# EAGLE schematic pcb_pedale_test-H743-TLV320AIC23B (EAGLE 9.6.2)
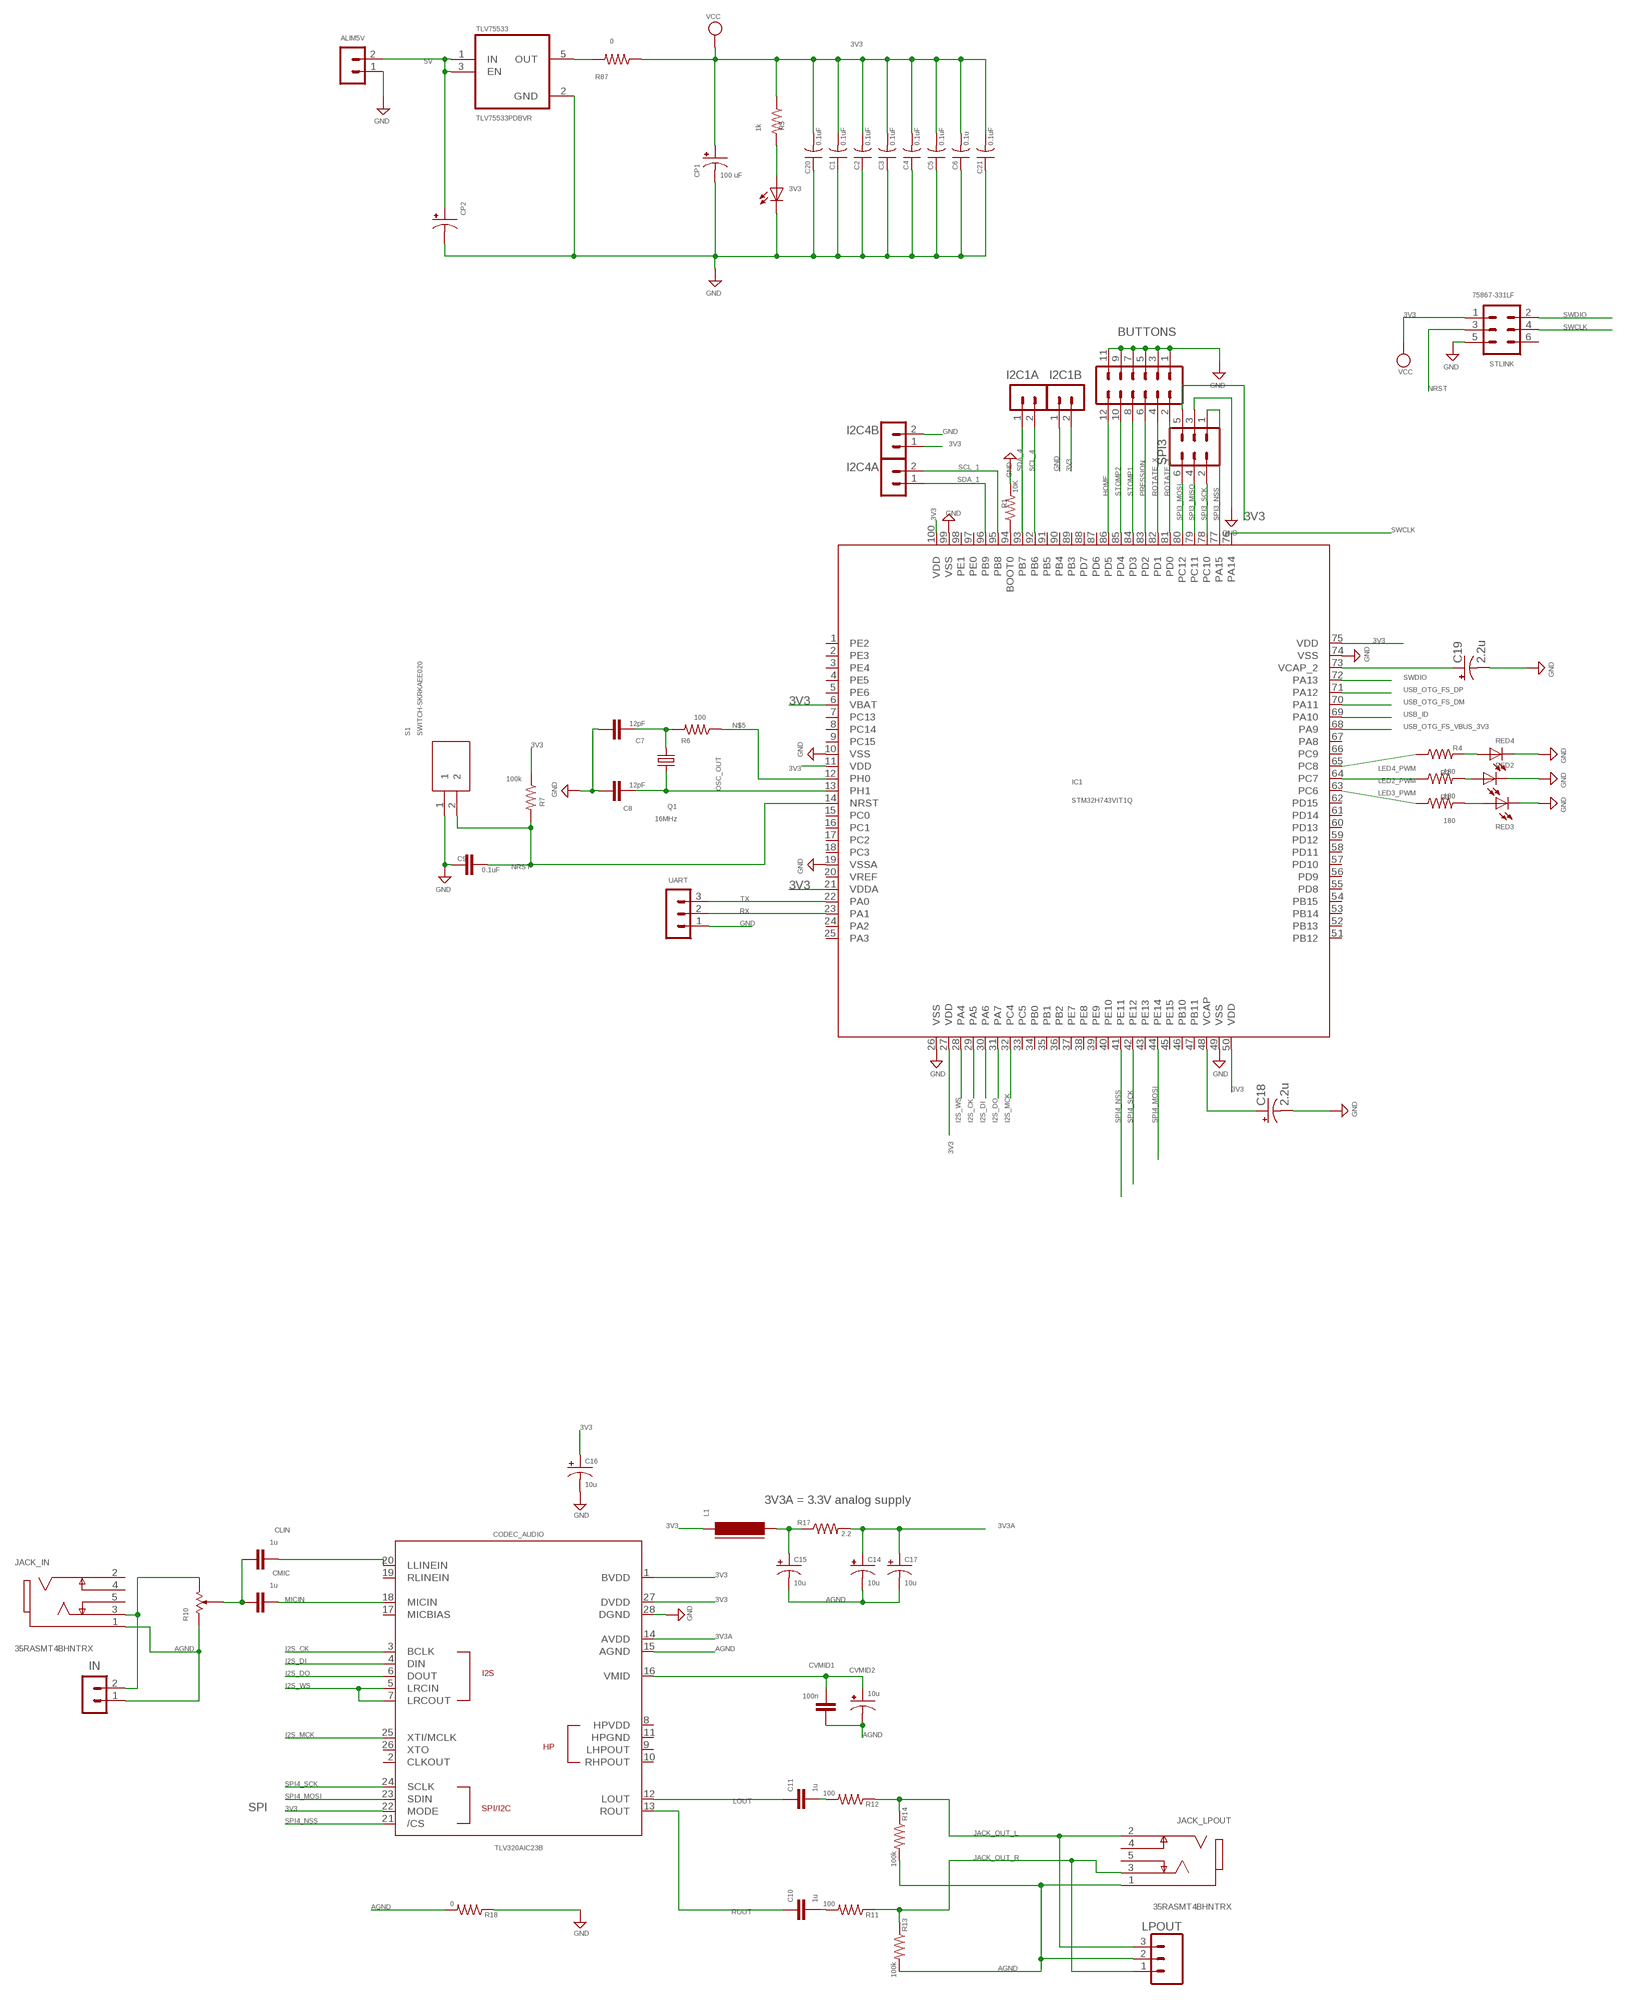
[diagram p0: schematic, sheet 1, part 1 of 2]
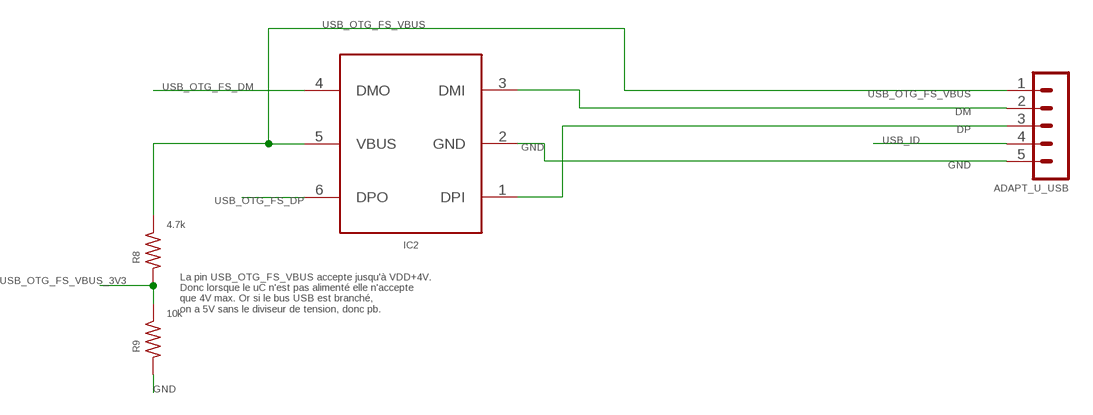
[diagram p1: schematic, sheet 1, part 2 of 2]

## Parts
3V3  LED-0805  [0805-LED]
ADAPT_U_USB  MA05-1  [MA05-1]
ALIM5V  MA02-1  [MA02-1]
BUTTONS  MA06-2  [MA06-2]
C1  0.1uF  C-US0805  [C0805]
C2  0.1uF  C-US0805  [C0805]
C3  0.1uF  C-US0805  [C0805]
C4  0.1uF  C-US0805  [C0805]
C5  0.1uF  C-US0805  [C0805]
C6  0.1u  C-US0805  [C0805]
C7  12pF  PASSIF-CAP-1206  [1206]
C8  12pF  PASSIF-CAP-1206  [1206]
C9  0.1uF  PASSIF-CAP-1206  [1206]
C10  1u  PASSIF-CAP-1206  [1206]
C11  1u  PASSIF-CAP-1206  [1206]
C14  10u  PASSIF-CPOL-US2917  [CPOL2917]
C15  10u  PASSIF-CPOL-US2917  [CPOL2917]
C16  10u  PASSIF-CPOL-US2917  [CPOL2917]
C17  10u  PASSIF-CPOL-US2917  [CPOL2917]
C18  2.2u  PASSIF-CPOL-US0805  [CPOL0805]
C19  2.2u  PASSIF-CPOL-US0805  [CPOL0805]
C20  0.1uF  C-US0805  [C0805]
C21  0.1uF  C-US0805  [C0805]
CLIN  1u  PASSIF-CAP-1206  [1206]
CMIC  1u  PASSIF-CAP-1206  [1206]
CODEC_AUDIO  TLV320AIC23B  [TSSOP28]
CP1  100 uF  CPOL-US2917  [CPOL2917]
CP2  10u  CPOL-US2917  [CPOL2917]
CVMID1  100n  PASSIF-CAP-0805  [0805-CAP]
CVMID2  10u  PASSIF-CPOL-US2917  [CPOL2917]
I2C1A  MA02-1  [MA02-1]
I2C1B  MA02-1  [MA02-1]
I2C4A  MA02-1  [MA02-1]
I2C4B  MA02-1  [MA02-1]
IC1  STM32H743VIT1Q  [LQFP100_14X14]
IC2  STF203-22  [SC70-6]
IN  MA02-1  [MA02-1]
JACK_IN  35RASMT4BHNTRX  [35RASMT4BHNTRX]
JACK_LPOUT  35RASMT4BHNTRX  [35RASMT4BHNTRX]
L1  FERRITE-0805  [FB805]
LPOUT  MA03  [03P]
Q1  16MHz  Q-HSEHC-46X  [Q-HC-46X]
R1  10K  R-US0805  [R0805]
R2  180  R-US0805  [R0805]
R3  180  R-US0805  [R0805]
R4  180  R-US0805  [R0805]
R5  1k  R-US0805  [R0805]
R6  100  R-US0805  [R0805]
R7  100k  R-US0805  [R0805]
R8  4.7k  R-US0805  [R0805]
R9  10k  R-US0805  [R0805]
R10  POTENTIOMETER-PTH  [POT-PTH]
R11  100  PASSIF-R-US0805  [R0805]
R12  100  PASSIF-R-US0805  [R0805]
R13  100k  PASSIF-R-US0805  [R0805]
R14  100k  PASSIF-R-US0805  [R0805]
R17  2.2  PASSIF-R-US0805  [R0805]
R18  0  PASSIF-R-US0805  [R0805]
R87  0  R-US0805  [R0805]
RED2  LED3MM  [LED3MM]
RED3  LED3MM  [LED3MM]
RED4  LED-0603  [0603-LED]
S1  SWITCH-SKRKAEE020  [SKRKAEE020]
SPI3  MA03-2  [MA03-2]
STLINK  75867-331LF  MA03-2  [MA03-2]
TLV75533  TLV75533PDBVR  [SOT95P280X145-5N]
UART  MA03-1PL  [MA03-1]

## Nets
3V3: C1.2 C2.2 C3.2 C4.2 C5.2 C6.2 C16.+ C20.2 C21.2 CODEC_AUDIO.1(BVDD) CODEC_AUDIO.22(MODE) CODEC_AUDIO.27(DVDD) CP1.+ I2C1B.2 I2C4B.1 IC1.6(VBAT) IC1.11(VDD) IC1.21(VDDA) IC1.27(VDD) IC1.50(VDD) IC1.75(VDD) IC1.100(VDD) L1.1 R5.1 R7.1 R87.1 SPI3.5 STLINK.1 ; supply symbol labelled VCC
3V3A: C14.+ C17.+ CODEC_AUDIO.14(AVDD) R17.2
5V: ALIM5V.2 CP2.+ TLV75533.1(IN) TLV75533.3(EN)
AGND: C14.- C15.- C17.- CODEC_AUDIO.15(AGND) CVMID1.2 CVMID2.- IN.1 JACK_IN.1 JACK_LPOUT.1 LPOUT.2 R10.3 R13.2 R14.2 R18.2
DM: ADAPT_U_USB.2 IC2.3(DMI)
DP: ADAPT_U_USB.3 IC2.1(DPI)
GND: 3V3.C ADAPT_U_USB.5 ALIM5V.1 BUTTONS.1 BUTTONS.3 BUTTONS.5 BUTTONS.7 BUTTONS.9 BUTTONS.11 C1.1 C2.1 C3.1 C4.1 C5.1 C6.1 C7.1 C8.1 C9.1 C16.- C18.2-(-) C19.2-(-) C20.1 C21.1 CODEC_AUDIO.28(DGND) CP1.- CP2.- I2C1B.1 I2C4B.2 IC1.10(VSS) IC1.19(VSSA) IC1.26(VSS) IC1.49(VSS) IC1.74(VSS) IC1.99(VSS) IC2.2(GND) R1.2 R9.2 R18.1 RED2.K(C) RED3.K(C) RED4.C S1.1 SPI3.3 STLINK.5 TLV75533.2(GND) UART.1
HOME: BUTTONS.12 IC1.86(PD5)
I2S_CK: CODEC_AUDIO.3(BCLK) IC1.29(PA5)
I2S_DI: CODEC_AUDIO.4(DIN) IC1.30(PA6)
I2S_DO: CODEC_AUDIO.6(DOUT) IC1.31(PA7)
I2S_MCK: CODEC_AUDIO.25(XTI/MCLK) IC1.32(PC4)
I2S_WS: CODEC_AUDIO.5(LRCIN) CODEC_AUDIO.7(LRCOUT) IC1.28(PA4)
JACK_OUT_L: JACK_LPOUT.2 LPOUT.3 R12.1 R14.1
JACK_OUT_R: JACK_LPOUT.3 LPOUT.1 R11.1 R13.1
LED2_PWM: IC1.64(PC7) R2.1
LED3_PWM: IC1.63(PC6) R3.1
LED4_PWM: IC1.65(PC8) R4.1
LOUT: C11.1 CODEC_AUDIO.12(LOUT)
MICIN: CMIC.2 CODEC_AUDIO.18(MICIN)
N$1: IC1.94(BOOT0) R1.1
N$3: C11.2 R12.2
N$4: R2.2 RED2.A
N$5: IC1.12(PH0) R6.1
N$6: R3.2 RED3.A
N$7: C10.2 R11.2
N$8: CLIN.2 CODEC_AUDIO.20(LLINEIN)
N$10: C15.+ L1.2 R17.1
N$11: C18.1+(+) IC1.48(VCAP)
N$12: C19.1+(+) IC1.73(VCAP_2)
N$13: CLIN.1 CMIC.1 R10.2
N$20: IN.2 JACK_IN.3 R10.1
N$25: R4.2 RED4.A
N$29: CODEC_AUDIO.16(VMID) CVMID1.1 CVMID2.+
N$57: 3V3.A R5.2
N$104: C7.2 Q1.1 R6.2
N$108: R87.2 TLV75533.5(OUT)
NRST: C9.2 IC1.14(NRST) R7.2 S1.2 STLINK.3
OSC_OUT: C8.2 IC1.13(PH1) Q1.2
PRESSION: BUTTONS.6 IC1.83(PD2)
ROTATE_X: BUTTONS.4 IC1.82(PD1)
ROTATE_Y: BUTTONS.2 IC1.81(PD0)
ROUT: C10.1 CODEC_AUDIO.13(ROUT)
RX: IC1.23(PA1) UART.2
SCL_1: I2C4A.2 IC1.95(PB8)
SCL_4: I2C1A.2 IC1.92(PB6)
SDA_1: I2C4A.1 IC1.96(PB9)
SDA_4: I2C1A.1 IC1.93(PB7)
SPI3_MISO: IC1.79(PC11) SPI3.4
SPI3_MOSI: IC1.80(PC12) SPI3.6
SPI3_NSS: IC1.77(PA15) SPI3.1
SPI3_SCK: IC1.78(PC10) SPI3.2
SPI4_MOSI: CODEC_AUDIO.23(SDIN) IC1.44(PE14)
SPI4_NSS: CODEC_AUDIO.21(/CS) IC1.41(PE11)
SPI4_SCK: CODEC_AUDIO.24(SCLK) IC1.42(PE12)
STOMP1: BUTTONS.8 IC1.84(PD3)
STOMP2: BUTTONS.10 IC1.85(PD4)
SWCLK: IC1.76(PA14) STLINK.4
SWDIO: IC1.72(PA13) STLINK.2
TX: IC1.22(PA0) UART.3
USB_ID: ADAPT_U_USB.4 IC1.69(PA10)
USB_OTG_FS_DM: IC1.70(PA11) IC2.4(DMO)
USB_OTG_FS_DP: IC1.71(PA12) IC2.6(DPO)
USB_OTG_FS_VBUS: ADAPT_U_USB.1 IC2.5(VBUS) R8.1
USB_OTG_FS_VBUS_3V3: IC1.68(PA9) R8.2 R9.1
Unconnected: CODEC_AUDIO.2(CLKOUT) CODEC_AUDIO.8(HPVDD) CODEC_AUDIO.9(LHPOUT) CODEC_AUDIO.10(RHPOUT) CODEC_AUDIO.11(HPGND) CODEC_AUDIO.17(MICBIAS) CODEC_AUDIO.19(RLINEIN) CODEC_AUDIO.26(XTO) IC1.1(PE2) IC1.2(PE3) IC1.3(PE4) IC1.4(PE5) IC1.5(PE6) IC1.7(PC13) IC1.8(PC14) IC1.9(PC15) IC1.15(PC0) IC1.16(PC1) IC1.17(PC2) IC1.18(PC3) IC1.20(VREF) IC1.24(PA2) IC1.25(PA3) IC1.33(PC5) IC1.34(PB0) IC1.35(PB1) IC1.36(PB2) IC1.37(PE7) IC1.38(PE8) IC1.39(PE9) IC1.40(PE10) IC1.43(PE13) IC1.45(PE15) IC1.46(PB10) IC1.47(PB11) IC1.51(PB12) IC1.52(PB13) IC1.53(PB14) IC1.54(PB15) IC1.55(PD8) IC1.56(PD9) IC1.57(PD10) IC1.58(PD11) IC1.59(PD12) IC1.60(PD13) IC1.61(PD14) IC1.62(PD15) IC1.66(PC9) IC1.67(PA8) IC1.87(PD6) IC1.88(PD7) IC1.89(PB3) IC1.90(PB4) IC1.91(PB5) IC1.97(PE0) IC1.98(PE1) JACK_IN.2 JACK_IN.4 JACK_IN.5 JACK_LPOUT.4 JACK_LPOUT.5 STLINK.6

## Notes on the sheet
- La pin USB_OTG_FS_VBUS accepte jusqu'à VDD+4V. 
  Donc lorsque le uC n'est pas alimenté elle n'accepte 
  que 4V max. Or si le bus USB est branché, 
  on a 5V sans le diviseur de tension, donc pb.
- 3V3A = 3.3V analog supply
- SPI

## Library data of the parts
3V3 RED4 = Passives:LED
ADAPT_U_USB = con-lstb:MA05-1: PIN HEADER; OC_FARNELL: unknown; OC_NEWARK: unknown
ALIM5V IN = MyComponents:MA02-1: Headers & Wire Housing, 1 Row, 3 Position
BUTTONS = con-lstb:MA06-2: PIN HEADER; OC_FARNELL: unknown; OC_NEWARK: unknown
C1-C6 C20 C21 = MyComponents:C-US: SMD Multilayer Ceramic Capacitor; MOUSER: 80-C0805C104J5RAUTO
C7-C11 CLIN CMIC CVMID1 = stock-perso:PASSIF-CAP
C14-C17 CVMID2 = stock-perso:PASSIF-CPOL-US: SMT Tantalum Capacitor; MOUSER: 581-TPSE477K010R0200
C18 C19 = stock-perso:PASSIF-CPOL-US: SMT Tantalum Capacitor; MOUSER: 581-TAJR225K016RNJ
CODEC_AUDIO = TI:TLV320AIC23B
CP1 CP2 = MyComponents:CPOL-US: SMT Tantalum Capacitor; MOUSER: 581-TPSE477K010R0200
I2C1A I2C1B I2C4A I2C4B = STM32_pi_board:MA02-1: Headers & Wire Housing, 1 Row, 3 Position
IC1 = stm32H7:STM32H743VIT: STM32L1_Med_density_LQFP100 edit this description Auto generated by make-symbol-device-package-bsdl.ulp Rev. 44 Source: STM32L1_Med_density_LQFP100.bsd
IC2 = MyComponents:STF203: USB EMI filtering and ESD protection; MOUSER: 947-STF203-22.TCT
JACK_IN JACK_LPOUT = Connectors:35RASMT4BHNTRX: CONN JACK STEREO 3.5MM SMD R/A Manufacturer's datasheet <http://www.switchcraft.com/Drawings/35rasmt4bhntrx_cd.pdf>; CREATED_BY: PCBLayout.com; DIGIKEY_PART_NUMBER: SC1488-1-ND; MANUFACTURER: Switchcraft Inc.; MPN: 35RASMT4BHNTRX
L1 = DP_devices:FERRITE: Ferrite bead in various packages
LPOUT = con-amp-quick:MA03: AMP QUICK CONNECTOR; OC_FARNELL: unknown; OC_NEWARK: unknown
Q1 = MyComponents:Q-HSE: HSE SMD Crystal; MOUSER: 520-160-20-46X
R1-R9 R87 = MyComponents:R-US: SMD Resistor; MOUSER: 660-RK73H2ATTDD1R00F
R10 = Passives:POTENTIOMETER
R11-R14 R17 R18 = stock-perso:PASSIF-R-US: SMD Resistor; MOUSER: 660-RK73H2ATTDD1R00F
RED2 RED3 = adafruit:LED: LED OSRAM: - CHIPLED LG R971, LG N971, LY N971, LG Q971, LY Q971, LO R971, LY R971 LH N974, LH R974 LS Q976, LO Q976, LY Q976 LO Q996 - Hyper CHIPLED LW Q18S LB Q993, LB Q99A, LB R99A - SideLED LS A670, LO A670, LY A670, LG A670, LP A670 LB A673, LV A673, LT A673, LW A673 LH A674 LY A675 LS A676, LA A676, LO A676, LY A676, LW A676 LS A679, LY A679, LG A679 - Hyper Micro SIDELED® LS Y876, LA Y876, LO Y876, LY Y876 LT Y87S - SmartLED LW L88C, LW L88S LB L89C, LB L89S, LG L890 LS L89K, LO L89K, LY L89K LS L896, LA L896, LO L896, LY L896 - TOPLED LS T670, LO T670, LY T670, LG T670, LP T670 LSG T670, LSP T670, LSY T670, LOP T670, LYG T670 LG T671, LOG T671, LSG T671 LB T673, LV T673, LT T673, LW T673 LH T674 LS T676, LA T676, LO T676, LY T676, LB T676, LH T676, LSB T676, LW T676 LB T67C, LV T67C, LT T67C, LS T67K, LO T67K, LY T67K, LW E67C LS E67B, LA E67B, LO E67B, LY E67B, LB E67C, LV E67C, LT E67C LW T67C LS T679, LY T679, LG T679 LS T770, LO T770, LY T770, LG T770, LP T770 LB T773, LV T773, LT T773, LW T773 LH T774 LS E675, LA E675, LY E675, LS T675 LS T776, LA T776, LO T776, LY T776, LB T776 LHGB T686 LT T68C, LB T68C - Hyper Mini TOPLED® LB M676 - Mini TOPLED Santana® LG M470 LS M47K, LO M47K, LY M47K Source: http://www.osram.convergy.de/
S1 = stock-perso:SWITCH-SKRKAEE020: Tactile Switches 3.9x2.9x2.0mm 160gf Packaging Temp 80oC Source: Datasheet <http://www.alps.com/prod/info/J/HTML/Tact/SurfaceMount/SKRK/SKRKAEE020.html>; DESCRIPTION: Tactile Switches 3.9x2.9x2.0mm 160gf Packaging Temp 80oC; HEIGHT: 2mm; MANUFACTURER_NAME: ALPS; MANUFACTURER_PART_NUMBER: SKRKAEE020; MOUSER_PART_NUMBER: 688-SKRKAEE020; MOUSER_PRICE-STOCK: https://www.mouser.co.uk/ProductDetail/ALPS/SKRKAEE020?qs=MrosSN5%252BUQW89XjXIp8Ugw%3D%3D
SPI3 STLINK = MyComponents:MA03-2: Headers & Wire Housing, 2 Row, 6 Position; MOUSER: 649-75867-331LF
TLV75533 = TLV75533PDBVR:TLV75533PDBVR: 500mA Low-IQ Small-Size Low-Dropout (LDO) Regulator 5-SOT-23 -40 to 125; AVAILABILITY: Unavailable; DESCRIPTION: Linear Voltage Regulator IC 1 Output 500mA SOT-23-5; MF: Texas Instruments; MP: TLV75533PDBVR; PACKAGE: SOT-23 Texas Instruments; PRICE: None
UART = MyComponents:MA03-1: Headers & Wire Housing, 1 Row, 3 Position